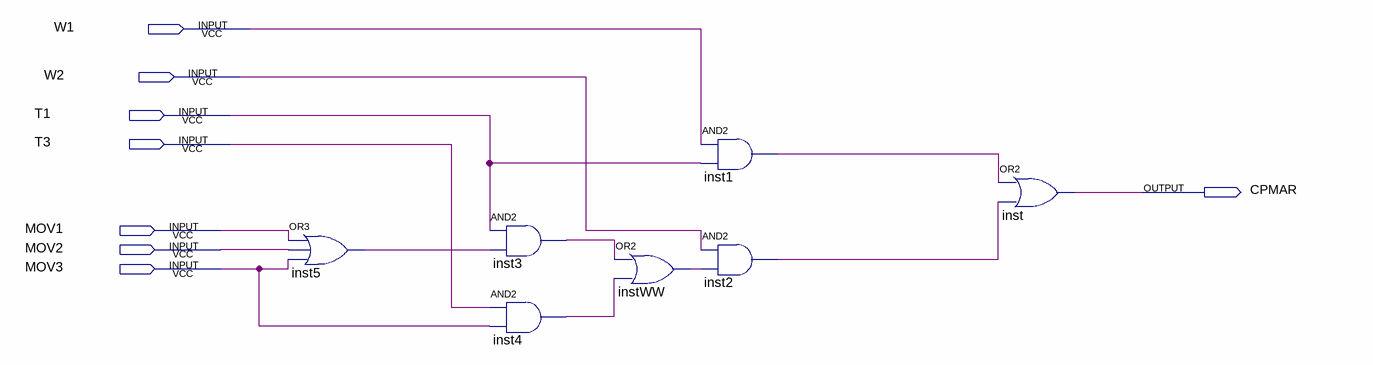
[diagram p0: schematic sheet]
// Quartus schematic CPMAR.bdf as structural Verilog: 7 symbols, 8 pins
module CPMAR (
  input  W1,
  input  W2,
  input  T1,
  input  T3,
  input  MOV1,
  input  MOV2,
  input  MOV3,
  output CPMAR
);

  wire inst1_out, inst2_out, inst3_out, inst4_out, inst5_out, instWW_out;

  or inst5 (inst5_out, MOV1, MOV2, MOV3);
  and inst3 (inst3_out, T1, inst5_out);
  and inst4 (inst4_out, T3, MOV3);
  or instWW (instWW_out, inst3_out, inst4_out);
  and inst1 (inst1_out, W1, T1);
  and inst2 (inst2_out, W2, instWW_out);
  or inst (CPMAR, inst1_out, inst2_out);
endmodule
